# EasyEDA schematic SCH_Diseño2_2023-11-16.json
TITLE: Sheet_1; REV: 1.0; Date: 2023-09-25; Sheet: 1/1; Drawn By: fabian.figueroa; Company: Your Company
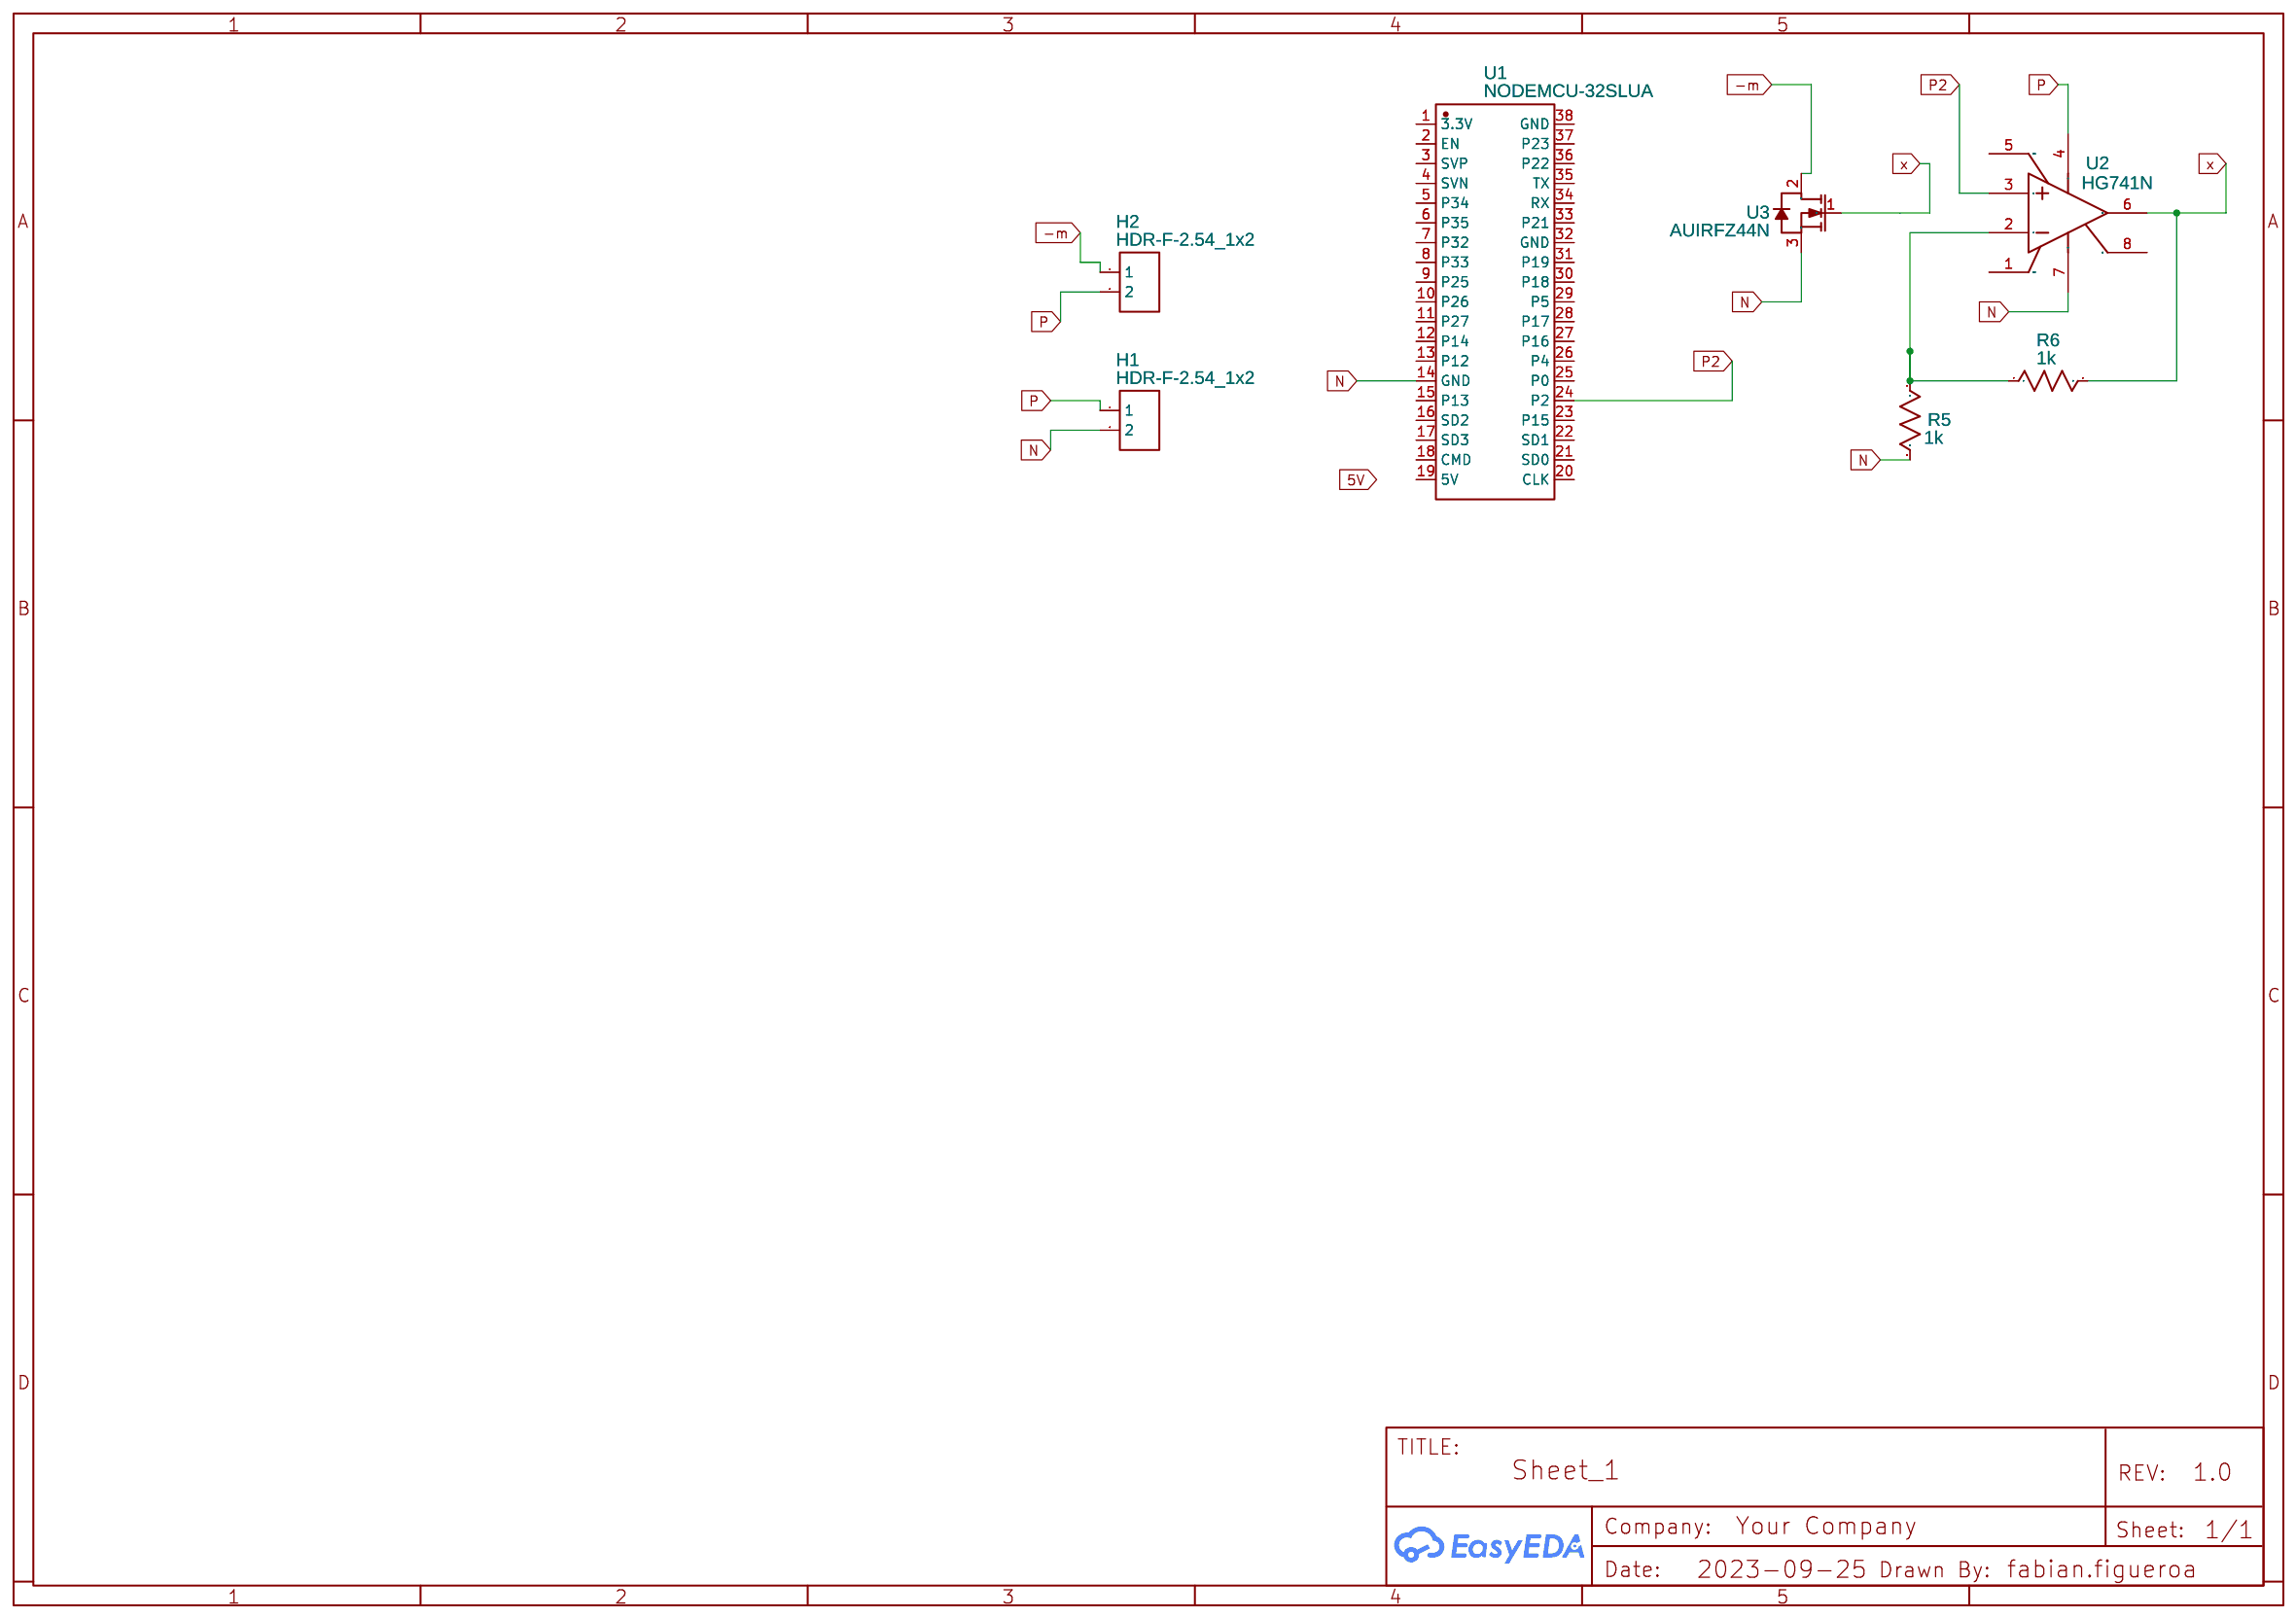
[diagram p0: schematic sheet]

## Parts
H1  HDR-F-2.54_1x2  [HDR-F-2.54_1X2]
H2  HDR-F-2.54_1x2  [HDR-F-2.54_1X2]
R5  1k  [R_AXIAL-0.4]
R6  1k  [R_AXIAL-0.4]
U1  NODEMCU-32SLUA  [COMM-TH_NODEMCU-32SLUA]
U2  HG741N  [DIP-8_L9.3-W6.4-P2.54-LS7.6-BL]
U3  AUIRFZ44N  [TO-220-3_L10.5-W4.8-P2.54-L]

## Library data of the parts
H1 H2 = HDR-F-2.54_1x2: Supplier Part: C49661; Supplier: LCSC; Contributor: LCEDA_Lib
R5 R6 = R_AXIAL-0.4_US: Contributor: LCEDA_Lib
U1 = NODEMCU-32SLUA: Contributor: lcsc; Supplier: LCSC; Supplier Part: C111436; Manufacturer: Ai-Thinker(安信可); Manufacturer Part: NodeMCU-32SLua; JLCPCB Part Class: Extended Part; link: https://lcsc.com/eda_search?q=C111436&%26type=1&ref=editor
U2 = HG741N: Contributor: lcsc; Supplier: LCSC; Supplier Part: C2926356; Manufacturer: HGSEMI(华冠); link: https://lcsc.com/eda_search?q=C2926356&%26type=1&ref=editor
U3 = AUIRFZ44N: Contributor: lcsc; Supplier: LCSC; Supplier Part: C3280774; Manufacturer: Infineon(英飞凌); link: https://lcsc.com/eda_search?q=C3280774&%26type=1&ref=editor

## Nets
-m: H2.1 U3.2(D)
N: H1.2 R5.2 U1.14(GND) U2.7(V+) U3.3(S)
P: H1.1 H2.2 U2.4(V-)
P2: U1.24(P2) U2.3(+IN)
x: R6.2 U2.6(VOUT) U3.1(G)
Net-(R5-1): R5.1 R6.1 U2.2(-IN)

Not connected (* = marked no-connect by the designer): U1 1(3.3V) 2(EN) 3(SVP) 4(SVN) 5(P34) 6(P35) 7(P32) 8(P33) 9(P25) 10(P26) 11(P27) 12(P14) 13(P12) 15(P13) 16(SD2) 17(SD3) 18(CMD) 19(5V) 20(CLK) 21(SD0) 22(SD1) 23(P15) 25(P0) 26(P4) 27(P16) 28(P17) 29(P5) 30(P18) 31(P19) 32(GND) 33(P21) 34(RX) 35(TX) 36(P22) 37(P23) 38(GND); U2 1(OFFSET NULL) 5(OFFSET NULL) 8(NC)
